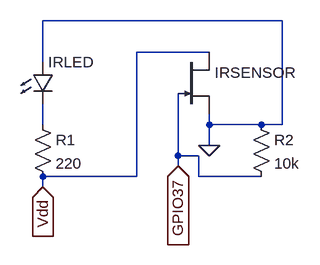
[diagram p0: schematic Draft2.asc]
Draft2.asc, the LTspice schematic file:
Version 4
SHEET 1 880 680
WIRE 368 32 0 32
WIRE 256 80 144 80
WIRE 0 96 0 32
WIRE 0 192 0 160
WIRE 256 192 256 176
WIRE 336 192 256 192
WIRE 368 192 368 32
WIRE 368 192 336 192
WIRE 256 224 256 192
WIRE 208 240 208 144
WIRE 240 240 208 240
WIRE 208 256 208 240
WIRE 144 272 144 80
WIRE 144 272 0 272
WIRE 240 272 240 240
WIRE 336 272 240 272
WIRE 0 288 0 272
FLAG 208 256 GPIO37
IOPIN 208 256 In
FLAG 256 224 0
FLAG 0 288 Vdd
IOPIN 0 288 In
SYMBOL njf 208 80 R0
SYMATTR InstName IRSENSOR
SYMATTR Value ""
SYMBOL LED -16 96 R0
SYMATTR InstName IRLED
SYMATTR Value ""
SYMBOL res -16 176 R0
SYMATTR InstName R1
SYMATTR Value 220
SYMBOL res 320 176 R0
SYMATTR InstName R2
SYMATTR Value 10k

The netlist it stands for:
* Draft2.asc
J§IRSENSOR Vdd GPIO37 0
D§IRLED 0 N001
R1 N001 Vdd 220
R2 0 GPIO37 10k
.model D D
.lib standard.dio
.model NJF NJF
.model PJF PJF
.lib standard.jft
.backanno
.end